# EAGLE design PayloadStandingV23 (EAGLE 9.0.0)
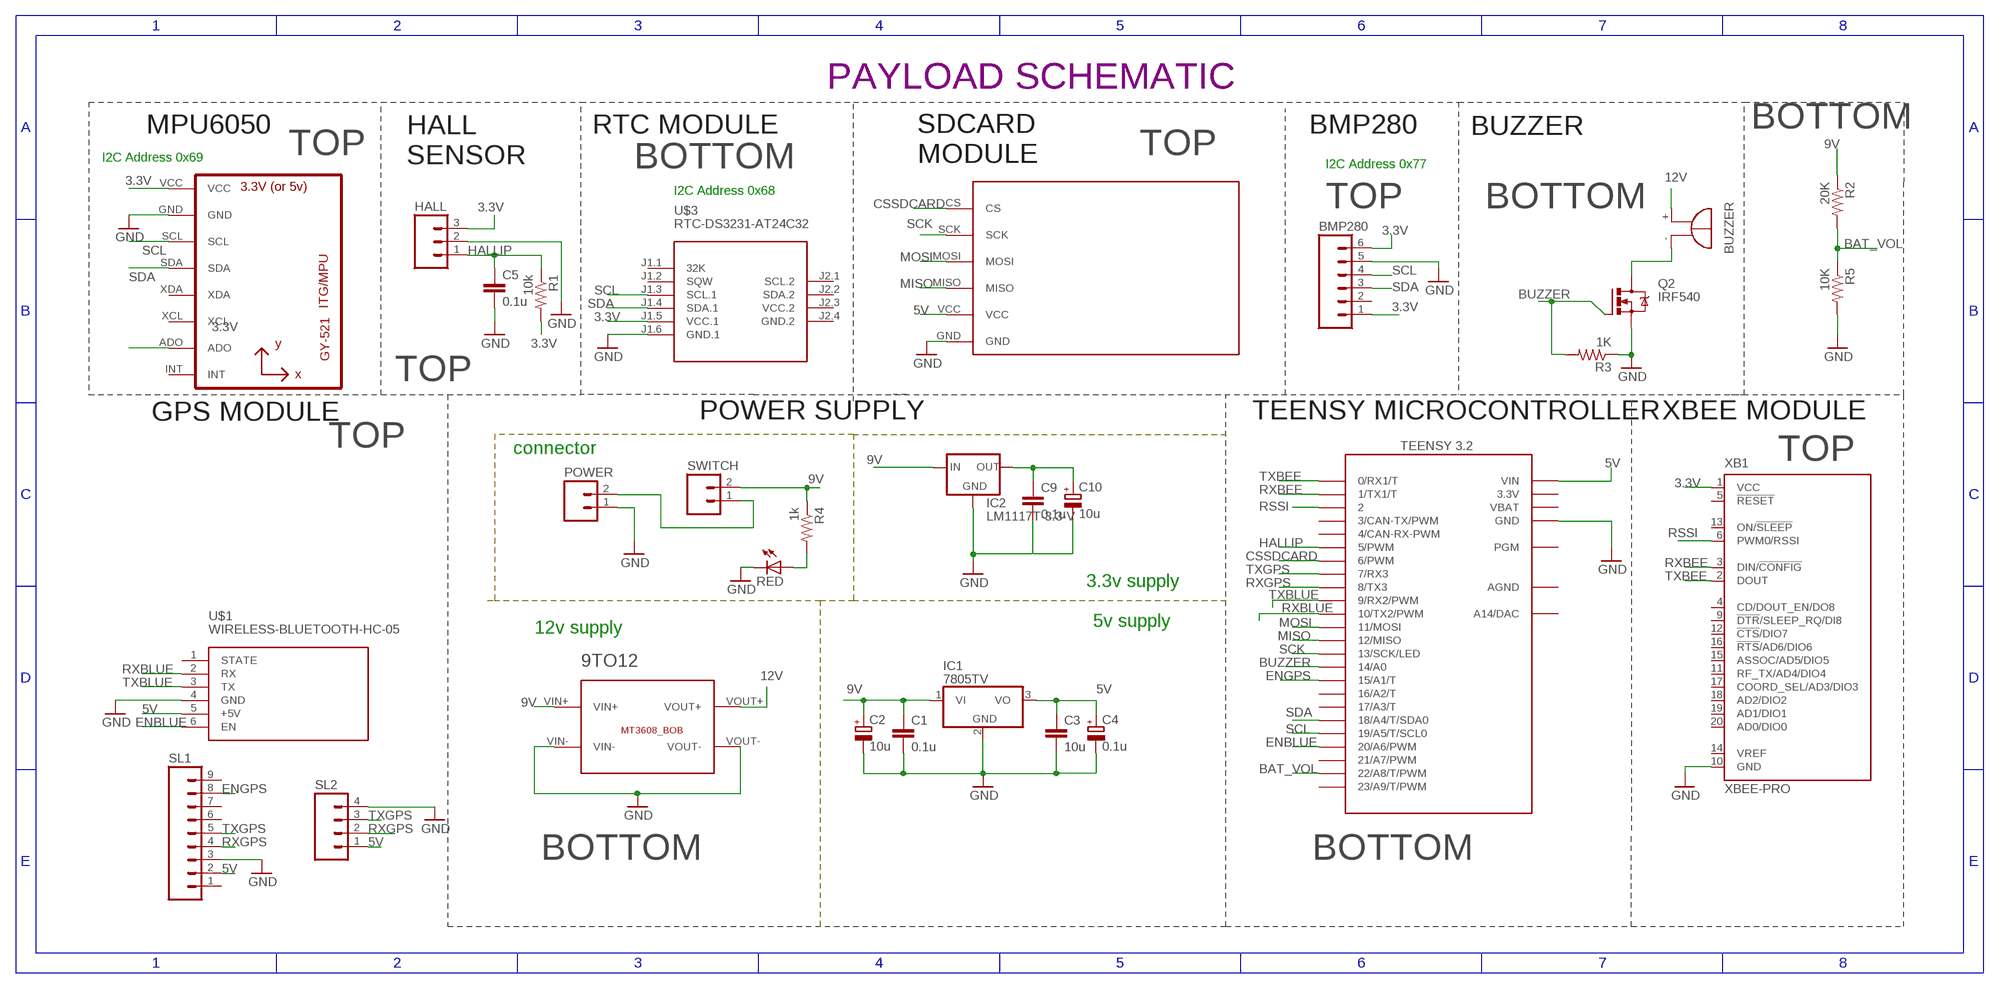
[diagram p0: schematic, sheet 1]

## Parts
9TO12  BREAKOUTS_MT3608_BOB  [BREAKOUTS_MT3608_BOB]
BMP280  M06  [06P]
C1  0.1u  C-EU025-025X050  [C025-025X050]
C2  10u  CPOL-EUE2.5-6  [E2,5-6]
C3  10u  C-EU025-025X050  [C025-025X050]
C4  0.1u  CPOL-EUE2.5-6  [E2,5-6]
C5  0.1u  C-EU025-025X050  [C025-025X050]
C9  0.1u  C-EU025-025X050  [C025-025X050]
C10  10u  CPOL-EUE2.5-6  [E2,5-6]
HALL  M03  [03P]
IC1  7805TV  [TO220V]
IC2  LM1117T-3.3-V  [TO220V]
POWER  CEDT_JANUARY_2015_V5_M02  [CEDT_JANUARY_2015_V5_02P]
Q2  IRF540  [TO220BV]
R1  10k  R-US_0204/7  [0204/7]
R2  20K  R-US_0204/7  [0204/7]
R3  1K  R-US_0204/7  [0204/7]
R4  1k  R-US_0204/7  [0204/7]
R5  10K  R-US_0204/7  [0204/7]
RED  red  LED3MM  [LED3MM]
SG1  BUZZER_EB2209A  [BUZZER_EB2209A]
SL1  M09  [09P]
SL2  CON-AMP-QUICK_M04  [CON-AMP-QUICK_04P]
SWITCH  M02  [02P]
U1  GY-521MPU6050  [GY-521]
U$1  WIRELESS-BLUETOOTH-HC-05  [WIRELESS-BLUETOOTH-HC-05]
U$2  TEENSY_3.1-3.2_OUTER_ROW  [TEENSY_3.0-3.2&LC_OUTER_ROW]
U$3  RTC-DS3231-AT24C32  [RTC-DS3231-AT24C32]
U$5  SDCARD  [M0SDCARDMODULE]
XB1  XBEE-PRO  [XBEE-PRO]

## Nets
3.3V [power]: BMP280.1 BMP280.6 C9.1 C10.+ HALL.3 IC2.2(OUT) R1.2 U1.ADO U1.VCC U$3.J1.5(VCC.1) XB1.1(VCC)
5V [power]: C3.1 C4.+ IC1.3(VO) SL1.2 SL2.1 U$1.5(+5V) U$2.VIN U$5.VCC
9V [power]: 9TO12.VIN+ C1.1 C2.+ IC1.1(VI) IC2.3(IN) R2.1 R4.1 SWITCH.2
12V [power]: 9TO12.VOUT+ SG1.+
BAT_VOL: R2.2 R5.1 U$2.22/A8(22/A8/T/PWM)
BUZZER: Q2.G R3.2 U$2.14/A0
CSSDCARD: U$2.6(6/PWM) U$5.CS
ENBLUE: U$1.6(EN) U$2.20/A6(20/A6/PWM)
ENGPS: SL1.8 U$2.15/A1(15/A1/T)
GND [power]: 9TO12.VIN- 9TO12.VOUT- BMP280.5 C1.2 C2.- C3.2 C4.- C5.2 C9.2 C10.- HALL.2 IC1.2(GND) IC2.1(GND) POWER.1 Q2.S R3.1 R5.2 RED.K(C) SL1.3 SL2.4 U1.GND U$1.4(GND) U$2.GND U$2.GND1(GND) U$3.J1.6(GND.1) U$5.GND XB1.10(GND)
HALLIP: C5.1 HALL.1 R1.1 U$2.5(5/PWM)
MISO: U$2.12(12/MISO) U$5.MISO
MOSI: U$2.11(11/MOSI) U$5.MOSI
N$1 [power]: POWER.2 SWITCH.1
N$2: R4.2 RED.A
N$3 [power]: Q2.D SG1.-
RSSI: U$2.2 XB1.6(PWM0/RSSI)
RXBEE: U$2.1(1/TX1/T) XB1.3(DIN/!CONFIG)
RXBLUE: U$1.2(RX) U$2.10(10/TX2/PWM)
RXGPS: SL1.4 SL2.2 U$2.8(8/TX3)
SCK: U$2.13(13/SCK/LED) U$5.SCK
SCL: BMP280.4 U1.SCL U$2.19/A5(19/A5/T/SCL0) U$3.J1.3(SCL.1)
SDA: BMP280.3 U1.SDA U$2.18/A4(18/A4/T/SDA0) U$3.J1.4(SDA.1)
TXBEE: U$2.0(0/RX1/T) XB1.2(DOUT)
TXBLUE: U$1.3(TX) U$2.9(9/RX2/PWM)
TXGPS: SL1.5 SL2.3 U$2.7(7/RX3)
Unconnected: BMP280.2 SL1.1 SL1.6 SL1.7 SL1.9 U1.INT U1.XCL U1.XDA U$1.1(STATE) U$2.3(3/CAN-TX/PWM) U$2.4(4/CAN-RX-PWM) U$2.16/A2(16/A2/T) U$2.17/A3(17/A3/T) U$2.21/A7(21/A7/PWM) U$2.23/A9(23/A9/T/PWM) U$2.PGM U$2.RESET/DAC(A14/DAC) U$3.J1.1(32K) U$3.J1.2(SQW) U$3.J2.1(SCL.2) U$3.J2.2(SDA.2) XB1.4(CD/DOUT_EN/DO8) XB1.5(!RESET) XB1.9(!DTR!/SLEEP_RQ/DI8) XB1.11(RF_TX/AD4/DIO4) XB1.12(!CTS!/DIO7) XB1.13(ON/!SLEEP) XB1.14(VREF) XB1.15(ASSOC/AD5/DIO5) XB1.16(!RTS!/AD6/DIO6) XB1.17(COORD_SEL/AD3/DIO3) XB1.18(AD2/DIO2) XB1.19(AD1/DIO1) XB1.20(AD0/DIO0)

## Notes on the sheet
- PAYLOAD SCHEMATIC
- MPU6050 | RTC MODULE | BMP280 | BUZZER | BOTTOM
- TOP | TOP
- I2C Address 0x69
- SDCARD
  MODULE
- HALL
  SENSOR
- BOTTOM | I2C Address 0x77
- I2C Address 0x68
- TOP | BOTTOM
- TOP
- GPS MODULE | POWER SUPPLY | TEENSY MICROCONTROLLER | XBEE MODULE
- TOP
- connector
- TOP
- 3.3v supply
- 5v supply
- 12v supply
- BOTTOM | BOTTOM

## Power pins joined to a net without a drawn wire
3.3V: U$2.3.3V U$2.3.3V1(3.3V)
AGND: U$2.AGND
GND.2: U$3.J2.4(GND.2)
VBAT: U$2.VBAT
VCC.2: U$3.J2.3(VCC.2)

## Library data of the parts
9TO12 = Cansat2019_3279_Container_v01:BREAKOUTS_MT3608_BOB
BMP280 = con-amp-quick:M06: AMP QUICK CONNECTOR; OC_FARNELL: unknown; OC_NEWARK: unknown
C1 C3 C5 C9 = resistor:C-EU: CAPACITOR, European symbol
C2 C4 C10 = rcl:CPOL-EU: POLARIZED CAPACITOR, European symbol; SPICEPREFIX: C
HALL = con-amp-quick:M03: AMP QUICK CONNECTOR; OC_FARNELL: unknown; OC_NEWARK: unknown
IC1 = linear:78*: Positive VOLTAGE REGULATOR Source: http://cache.national.com/ds/LM/LM78L05.pdf http://www.fairchildsemi.com/ds/LM/LM7805.pdf
IC2 = lm1117:LM1117T-*
POWER = Cansat2019_3279_Container_v01:CEDT_JANUARY_2015_V5_M02: AMP QUICK CONNECTOR
Q2 = transistor-power:IRF540: HEXFET Power MOSFET
R1-R5 = rcl:R-US_: RESISTOR, American symbol; SPICEPREFIX: R
RED = CEDT_JANUARY_2015_v5:LED
SG1 = Cansat2019_3279_Container_v01:BUZZER_EB2209A: BUZZER Source: Buerklin; OC_FARNELL: unknown; OC_NEWARK: unknown
SL1 = con-amp-quick:M09: AMP QUICK CONNECTOR; OC_FARNELL: unknown; OC_NEWARK: unknown
SL2 = ADC_CPLDV8:CON-AMP-QUICK_M04: AMP QUICK CONNECTOR; OC_FARNELL: unknown; OC_NEWARK: unknown
SWITCH = CEDT_JANUARY_2015_v5:M02: AMP QUICK CONNECTOR
U1 = gy-521:GY-521
U$1 = diy-modules(1):WIRELESS-BLUETOOTH-HC-05: Bluetooth Transceiver Module based on HC-05 board Tutorial is available here: https://arduino-info.wikispaces.com/BlueTooth-HC05-HC06-Modules-How-To Click here to find device on ebay.com <http://www.ebay.com/sch/hc-05+module+rs232>
U$2 = Teensy_3_and_LC_Series_Boards_v1.4:TEENSY_3.1-3.2_OUTER_ROW: Footprint for Teensy 3.1 or 3.2 board using all pin connections on the outer perimeter
U$3 = diy-modules:RTC-DS3231-AT24C32: RTC Module with Battery and EEPROM based on DS3231 and AT24C32 chips Tutorial can be found here: https://edwardmallon.wordpress.com/2014/05/21/using-a-cheap-3-ds3231-rtc-at24c32-eeprom-from-ebay/ Click here to find device on ebay.com <http://www.ebay.com/sch/DS3231+AT24C32+module>
U$5 = mylib:SDCARD
XB1 = maxstream:XBEE: XBee (TM) /XBee-PRO(TM) OEM RF Modules Source: MaxStream, Inc. xbee_productmanual.pdf; MPN: XBP24-AWI-001; OC_FARNELL: 1337916; OC_NEWARK: 42M2667

## Net classes
0 default: width 0.508 mm
1 power: width 0.61 mm

## Board
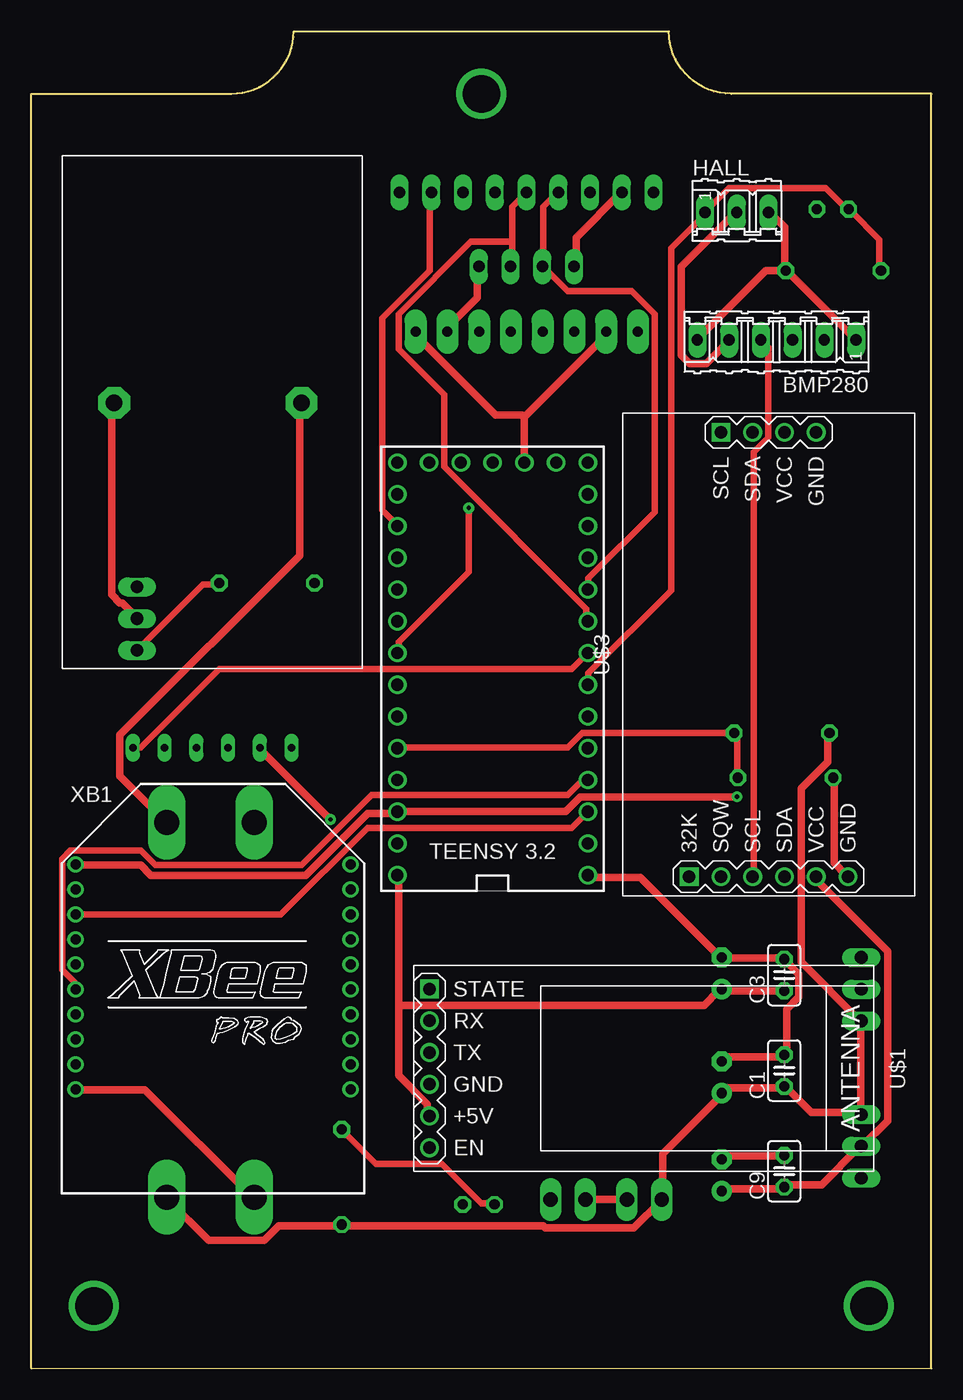
[diagram p1: board, top side]
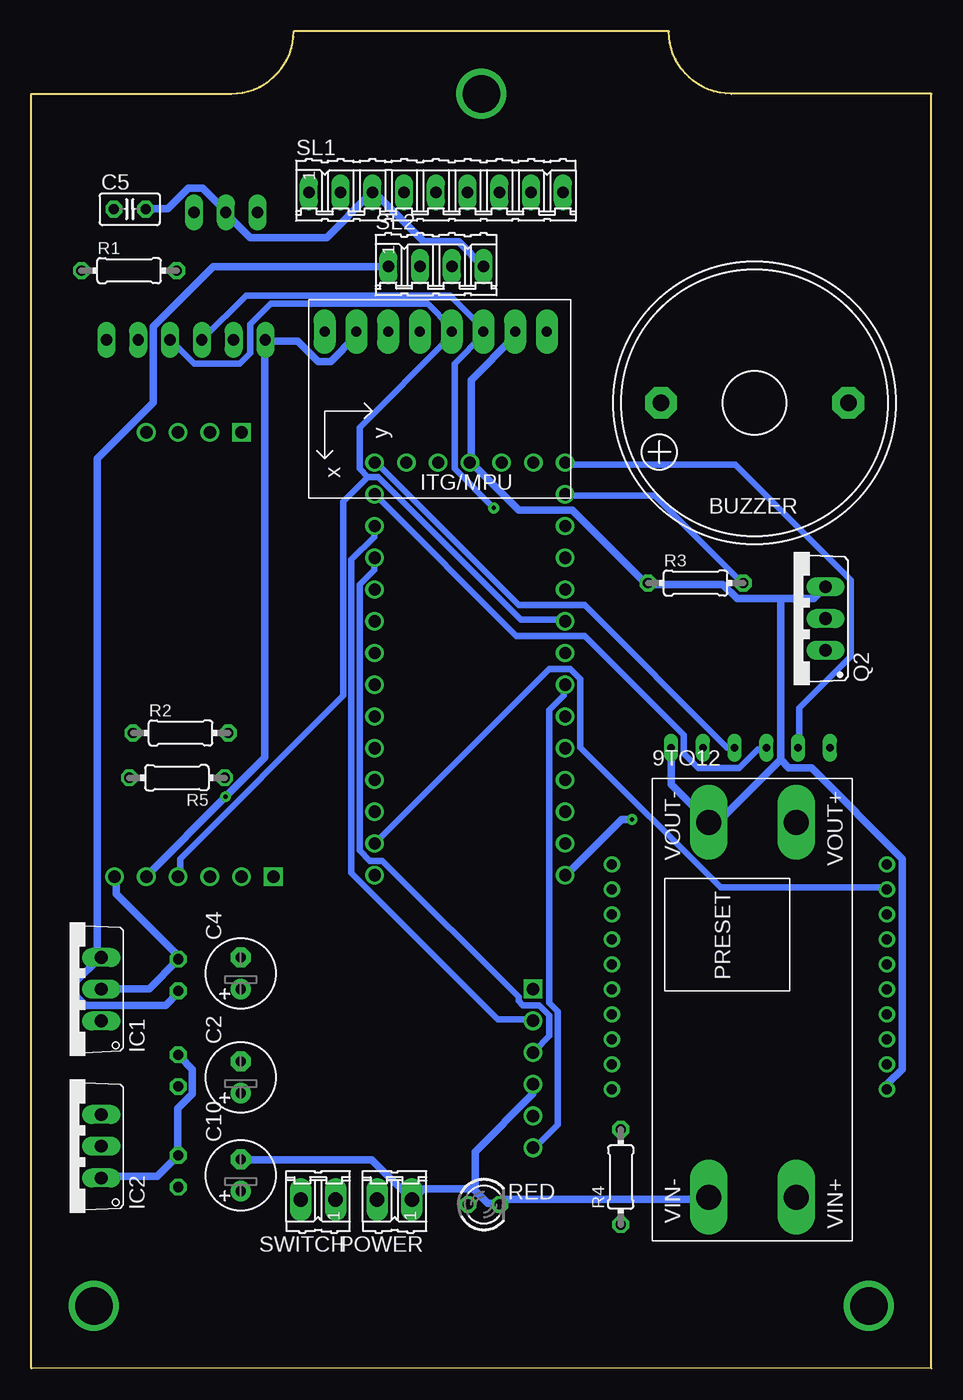
[diagram p2: board, bottom side, seen from below]

Size 72 x 107 mm. Coordinates in mm from the lower left corner, seen from the top.
Outline: 0,0 72,0 72,102 56,102 arc-90 51,107 21,107 arc-90 16,102 0,102 0,0
Copper layers (1*16): Top 0.035mm / dielectric 1.5mm / Bottom 0.035mm
Design rules "default *": minimum track width 6mil, minimum drill 0.35mm, track to track 6mil, track to pad 6mil, pad to pad 6mil, via to via 6mil, smd to smd 6mil, copper to edge 40mil, drill to drill 6mil, minimum pad ring 10mil, minimum via ring 10mil, stop-mask expansion 4mil, vias tented up to drill 0mil, thermal gap 10mil

### Footprints (pad centres in the part's own frame; a part is rotated, then mirrored left to right if it is on the bottom)
BREAKOUTS_MT3608_BOB = drill 2 pad 3 long: VIN+ 33.5,-4.5; VIN- 33.5,-11.5; VOUT+ 3.5,-4.5; VOUT- 3.5,-11.5
06P = drill 0.914 long: 1 -6.35,0; 2 -3.81,0; 3 -1.27,0; 4 1.27,0; 5 3.81,0; 6 6.35,0
C025-025X050 = drill 0.813 octagon: 1 -1.27,0; 2 1.27,0
E2,5-6 = drill 0.813 pad 1.6: + -1.27,0 | drill 0.813 pad 1.6 octagon: - 1.27,0
03P = drill 0.914 long: 1 -2.54,0; 2 0,0; 3 2.54,0
TO220V = drill 1.016 long: 1 -2.54,-2.54; 2 0,-2.54; 3 2.54,-2.54
CEDT_JANUARY_2015_V5_02P = drill 1.143 long: 1 -1.397,0; 2 1.397,0
TO220BV = drill 1.016 long: D 0,-2.54; G -2.54,-2.54; S 2.54,-2.54
0204/7 = drill 0.813 octagon: 1 -3.81,0; 2 3.81,0
LED3MM = drill 0.813 octagon: A -1.27,0; K 1.27,0
BUZZER_EB2209A = drill 1.321 pad 2.54 octagon: + 7.493,0; - -7.493,0
09P = drill 0.914 long: 1 -10.16,0; 2 -7.62,0; 3 -5.08,0; 4 -2.54,0; 5 0,0; 6 2.54,0; 7 5.08,0; 8 7.62,0; 9 10.16,0
CON-AMP-QUICK_04P = drill 0.914 long: 1 -3.81,0; 2 -1.27,0; 3 1.27,0; 4 3.81,0
02P = drill 1.143 long: 1 -1.397,0; 2 1.397,0
GY-521 = drill 0.8 pad 1.778 long: ADO -8.89,-6.35; GND -8.89,6.35; INT -8.89,-8.89; SCL -8.89,3.81; SDA -8.89,1.27; VCC -8.89,8.89; XCL -8.89,-3.81; XDA -8.89,-1.27
WIRELESS-BLUETOOTH-HC-05 = drill 1 square: 1 -6.35,-17.145 | drill 1: 2 -3.81,-17.145; 3 -1.27,-17.145; 4 1.27,-17.145; 5 3.81,-17.145; 6 6.35,-17.145
TEENSY_3.0-3.2&LC_OUTER_ROW = drill 0.965: 0 -7.62,13.97; 1 -7.62,11.43; 2 -7.62,8.89; 3 -7.62,6.35; 3.3V 7.62,11.43; 3.3V1 -2.54,-16.51; 4 -7.62,3.81; 5 -7.62,1.27; 6 -7.62,-1.27; 7 -7.62,-3.81; 8 -7.62,-6.35; 9 -7.62,-8.89; 10 -7.62,-11.43; 11 -7.62,-13.97; 12 -7.62,-16.51; 13 7.62,-16.51; 14/A0 7.62,-13.97; 15/A1 7.62,-11.43; 16/A2 7.62,-8.89; 17/A3 7.62,-6.35; 18/A4 7.62,-3.81; 19/A5 7.62,-1.27; 20/A6 7.62,1.27; 21/A7 7.62,3.81; 22/A8 7.62,6.35; 23/A9 7.62,8.89; AGND 7.62,13.97; GND -7.62,16.51; GND1 0,-16.51; PGM 2.54,-16.51; RESET/DAC 5.08,-16.51; VBAT -5.08,-16.51; VIN 7.62,16.51
RTC-DS3231-AT24C32 = drill 1 square: J1.1 -17.78,6.35; J2.1 17.78,3.81 | drill 1: J1.2 -17.78,3.81; J1.3 -17.78,1.27; J1.4 -17.78,-1.27; J1.5 -17.78,-3.81; J1.6 -17.78,-6.35; J2.2 17.78,1.27; J2.3 17.78,-1.27; J2.4 17.78,-3.81
M0SDCARDMODULE = drill 0.6 long: CS -6.35,6.35; GND -6.35,-6.35; MISO -6.35,-1.27; MOSI -6.35,1.27; SCK -6.35,3.81; VCC -6.35,-3.81
XBEE-PRO = drill 0.8 pad 1.27: 1 -11,9; 2 -11,7; 3 -11,5; 4 -11,3; 5 -11,1; 6 -11,-1; 7 -11,-3; 8 -11,-5; 9 -11,-7; 10 -11,-9; 11 11,-9; 12 11,-7; 13 11,-5; 14 11,-3; 15 11,-1; 16 11,1; 17 11,3; 18 11,5; 19 11,7; 20 11,9

### Placement (x,y rotation side)
9TO12  6.32,47.2 270 bottom
BMP280  59.63,82.29 180 top
C1  60.24,23.82 90 top
C2  55.24,23.29 90 bottom
C3  60.24,31.47 90 top
C4  55.24,31.61 90 bottom
C5  64.12,92.76 0 bottom
C9  60.24,15.77 90 top
C10  55.24,15.45 90 bottom
HALL  56.44,92.49 0 top
IC1  68.94,30.34 90 bottom
IC2  68.94,17.77 90 bottom
POWER  42.94,13.51 180 bottom
Q2  11,60 90 bottom
R1  64.17,87.84 0 bottom
R2  60.05,50.84 0 bottom
R3  18.85,62.84 0 bottom
R4  24.84,15.31 90 bottom
R5  60.34,47.26 180 bottom
RED  35.79,13.11 0 bottom
SG1  14.13,77.26 180 bottom
SL1  39.62,94.11 0 bottom
SL2  39.62,88.16 0 bottom
SWITCH  49.05,13.51 180 bottom
U1  39.63,74.08 270 bottom
U$1  49,24 270 top
U$2  36.91,55.97 180 top
U$3  58.99,57.12 90 top
U$5  14.47,56.02 90 top
XB1  14.55,31.32 0 top

### Tracks (layer width: path | path; a pad name or v marks a point on that pad's centre or on a via)
3.3V  (via drill 0.35)
  Top 0.61: R1.2 60.26,88 60.26,91.3 59.11,92.46 HALL.3 | BMP280.6 53.33,82.39 58.78,87.83 60.1,87.83 R1.2 | BMP280.1 65.88,82.39 60.59,87.67 R1.2 | 39.46,76.11 U$2.3.3V1 | 39.46,76.11 45.9,82.55 45.9,82.88 U1.ADO | U1.VCC 30.87,82.88 30.87,82.55 37.15,76.28 39.29,76.28 39.46,76.11 | XB1.1 3.63,40.28 8.75,40.28 9.58,39.46 21.96,39.46 26.91,44.41 29.22,44.41 U$2.3.3V 29.55,44.58 42.76,44.58 43.92,45.73 v56.46,45.73 | C10.+ 55.31,14.2 55.47,14.36 60.1,14.36 C9.1 60.43,14.69 63.23,14.69 66.2,17.67 IC2.2 66.53,17.83 68.52,19.81 68.52,33.35 62.9,38.96 62.9,39.29 U$3.J1.5
  Bottom 0.61: U1.ADO 46.06,82.88 46.06,82.55 48.04,80.57 49.03,80.57 50.69,82.22 53.16,82.22 BMP280.6 53.33,82.06 53.33,48.87 v56.46,45.73 62.74,39.46 U$3.J1.5
5V  (via drill 0.35)
  Top 0.61: v23.94,43.92 18.33,49.53 U$5.VCC | 29.39,29.06 29.39,39.29 U$2.VIN | 29.39,29.06 29.39,23.44 31.7,21.13 31.7,20.31 U$1.5 | SL2.1 43.59,88.16 43.59,90.47 47.22,94.11 SL1.2 | C3.1 60.1,30.21 55.31,30.21 C4.+ 54.98,30.21 53.82,29.06 29.39,29.06
  Bottom 0.61: v23.94,43.92 24.77,43.92 29.22,39.46 U$2.VIN | C3.1 60.26,30.05 61.25,29.06 67.69,29.06 68.52,29.88 68.52,30.87 66.53,32.85 IC1.3 66.7,33.02 66.7,72.81 62.24,77.27 62.24,83.38 57.45,88.16 SL2.1
9V
  Top 0.61: R2.1 63.73,50.69 63.73,48.54 61.58,46.39 61.58,32.52 66.37,27.74 IC1.1 66.37,27.57 66.37,20.64 IC2.3 66.37,20.47 62.41,20.47 60.43,22.45 C1.1 60.1,22.45 55.64,22.45 55.31,22.12 C2.+ 55.14,21.79 50.52,17.17 50.52,13.54 SWITCH.2 50.35,13.37 48.21,11.23 41.11,11.23 40.95,11.39 25.09,11.39 R4.1 24.77,11.39 19.81,11.39 18.66,10.24 14.2,10.24 10.9,13.54 9TO12.VIN+
12V
  Top 0.61: SG1.+ 21.46,77.1 21.46,65.05 7.1,50.69 7.1,47.38 10.73,43.75 9TO12.VOUT+
BAT_VOL
  Top 0.508: R5.1 56.46,47.38 56.46,50.52 56.3,50.69 R2.2 55.97,50.85 44.08,50.85 42.93,49.7 29.39,49.7 U$2.22/A8
BUZZER
  Top 0.508: R3.2 15.02,62.74 13.7,62.74 8.59,57.62 Q2.G
  Bottom 0.508: U$2.14/A0 29.22,69.84 22.12,69.84 15.19,62.9 R3.2
CSSDCARD
  Top 0.508: U$5.CS 8.26,49.7 8.75,49.7 15.02,55.97 43.26,55.97 44.41,57.12 U$2.6
ENBLUE
  Bottom 0.508: U$2.20/A6 29.39,54.65 29.39,53.82 30.54,52.67 30.54,29.22 29.88,28.56 29.88,19.48 31.7,17.67 U$1.6
ENGPS
  Top 0.508: SL1.8 31.86,94.11 31.86,87.83 28.07,84.04 28.07,68.68 29.22,67.53 U$2.15/A1
GND
  Top 0.61: XB1.10 3.63,22.29 9.08,22.29 17.67,13.7 9TO12.VIN- | C9.2 60.1,17 55.47,17 55.31,16.84 C10.- | R5.2 64.22,47.22 64.22,40.45 65.22,39.46 U$3.J1.6 | C2.- 55.31,24.6 55.64,24.93 60.1,24.93 C1.2 60.43,25.26 60.43,28.73 61.42,29.72 61.42,31.53 60.43,32.52 C3.2 60.1,32.85 55.31,32.85 C4.- 54.98,33.02 48.7,39.29 44.58,39.29 U$2.GND | BMP280.5 55.8,82.22 53.99,80.4 52.67,80.4 52.01,81.06 52.01,88.16 56.3,92.46 HALL.2 | SL2.4 35.66,88.16 35.66,85.69 33.35,83.38 33.35,83.05 U1.GND
  Bottom 0.61: 36.65,14.36 35.5,13.21 34.67,13.21 RED.K 34.34,13.21 34.01,13.54 17.83,13.54 9TO12.VIN- | 36.65,14.36 40.62,14.36 41.44,13.54 POWER.1 41.77,13.7 44.74,16.68 55.14,16.68 C10.- | U$1.4 31.86,22.62 31.86,21.96 36.49,17.34 36.49,14.53 36.65,14.36 | IC2.1 66.37,15.35 61.91,15.35 60.26,17 C9.2 60.26,17.34 60.26,20.8 59.11,21.96 59.11,23.94 60.1,24.93 C1.2 | IC1.2 66.37,30.38 62.57,30.38 60.26,32.69 C3.2 60.26,33.02 65.22,37.97 65.22,39.29 U$3.J1.6 | U$5.GND 20.8,49.53 20.8,46.72 17.83,43.75 9TO12.VOUT- 17.67,43.92 16.84,43.92 12.05,48.7 | 12.05,61.58 9.41,61.58 8.59,62.41 Q2.S | 12.05,61.58 15.52,61.58 16.68,62.74 22.62,62.74 R3.1 22.95,62.9 28.73,68.68 33.02,68.68 36.65,72.31 U$2.GND1 36.82,72.48 36.82,79.08 33.35,82.55 33.35,82.88 U1.GND | 12.05,61.58 12.05,48.7 | C5.2 62.74,92.79 61.09,92.79 59.44,94.44 58.28,94.44 56.46,92.62 HALL.2 56.3,92.29 54.48,90.47 48.37,90.47 44.91,93.94 SL1.3 44.58,94.11 40.62,90.14 37.81,90.14 35.83,88.16 SL2.4 | 12.05,48.7 11.39,48.04 9.58,48.04 2.31,40.78 2.31,23.94 3.47,22.78 3.47,22.45 XB1.10
HALLIP
  Top 0.508: R1.1 67.86,88 67.86,90.31 65.55,92.62 C5.1 65.22,92.79 63.56,94.44 55.8,94.44 53.99,92.62 HALL.1 53.82,92.29 51.18,89.65 51.18,62.24 44.58,55.64 44.58,54.81 U$2.5
MISO
  Bottom 0.508: U$5.MISO 15.85,49.7 16.34,49.7 27.74,61.09 33.02,61.09 44.41,72.48 U$2.12
MOSI
  Bottom 0.508: U$5.MOSI 13.21,49.53 13.87,49.53 15.35,48.04 18.66,48.04 19.81,49.2 19.81,50.69 27.74,58.61 33.19,58.61 44.41,69.84 U$2.11
N$1
  Top 0.61: POWER.2 44.41,13.54 47.55,13.54 SWITCH.1
N$2
  Top 0.508: RED.A 36.98,13.21 35.99,13.21 32.85,16.34 27.57,16.34 24.93,18.99 R4.2
N$3
  Top 0.61: Q2.D 8.42,60.1 7.26,61.25 7.1,61.25 6.44,61.91 6.44,76.94 6.6,77.1 SG1.-
N$4  (via drill 3)
  other vias: 67,5
N$5  (via drill 3)
  other vias: 5,5
N$6  (via drill 3)
  other vias: 36,102
RSSI
  Top 0.508: XB1.6 3.47,30.38 3.47,30.87 2.48,31.86 2.48,40.78 3.14,41.44 8.75,41.44 9.91,40.28 21.63,40.28 27.24,45.9 42.93,45.9 44.08,47.05 44.41,47.05 U$2.2
RXBEE
  Top 0.508: XB1.3 3.63,36.32 19.98,36.32 26.91,43.26 43.26,43.26 44.41,44.41 U$2.1
RXBLUE
  Bottom 0.508: U$2.10 44.58,67.36 44.58,66.53 46.39,64.72 46.39,39.62 34.67,27.9 31.86,27.9 U$1.2
RXGPS
  Top 0.508: SL1.4 42.1,94.11 40.95,92.95 40.95,88.16 SL2.2 41.11,88 42.93,86.18 48.04,86.18 49.86,84.37 49.86,68.52 44.58,63.23 44.58,62.41 U$2.8
SCK
  Bottom 0.508: U$5.SCK 10.57,49.7 10.57,52.83 6.44,56.96 6.44,63.07 15.68,72.31 29.22,72.31 U$2.13
SCL  (via drill 0.35)
  Top 0.508: v35,68.85 35,63.73 29.39,58.12 29.39,57.29 U$2.19/A5 | U$3.J1.3 57.78,39.46 57.78,73.3 58.94,74.46 58.94,81.72 58.45,82.22 BMP280.4
  Bottom 0.508: BMP280.4 58.28,82.39 54.81,85.85 38.47,85.85 35.66,83.05 U1.SCL 35.83,82.72 38.14,80.4 38.14,71.98 v35,68.85
SDA
  Bottom 0.508: BMP280.3 60.76,82.22 58.94,80.4 55.31,80.4 54.48,81.23 54.48,83.54 52.83,85.19 40.28,85.19 38.47,83.38 38.47,83.05 U1.SDA 38.63,82.88 38.63,82.39 45.73,75.29 45.73,71.98 45.07,71.32 | 45.07,71.32 44.25,71.32 32.85,59.93 29.39,59.93 U$2.18/A4 | 45.07,71.32 47.05,69.34 47.05,53.82 60.1,40.78 60.1,39.46 U$3.J1.4
TXBEE
  Bottom 0.508: XB1.2 3.63,38.47 16.84,38.47 28.07,49.7 28.07,55.14 28.89,55.97 30.54,55.97 44.41,42.1 U$2.0
TXBLUE
  Bottom 0.508: U$2.9 44.58,64.72 44.58,63.89 45.73,62.74 45.73,41.44 44.91,40.62 43.92,40.62 33.02,29.72 33.02,29.39 32.69,29.06 31.37,29.06 30.54,28.23 30.54,26.58 31.7,25.43 U$1.3
TXGPS
  Top 0.508: 38.47,90.14 38.47,92.95 SL1.5 | 38.47,90.14 38.47,88.16 SL2.3 | 38.47,90.14 35.17,90.14 29.39,84.37 29.39,81.56 33.02,77.93 33.02,72.15 44.41,60.76 44.41,59.93 U$2.7